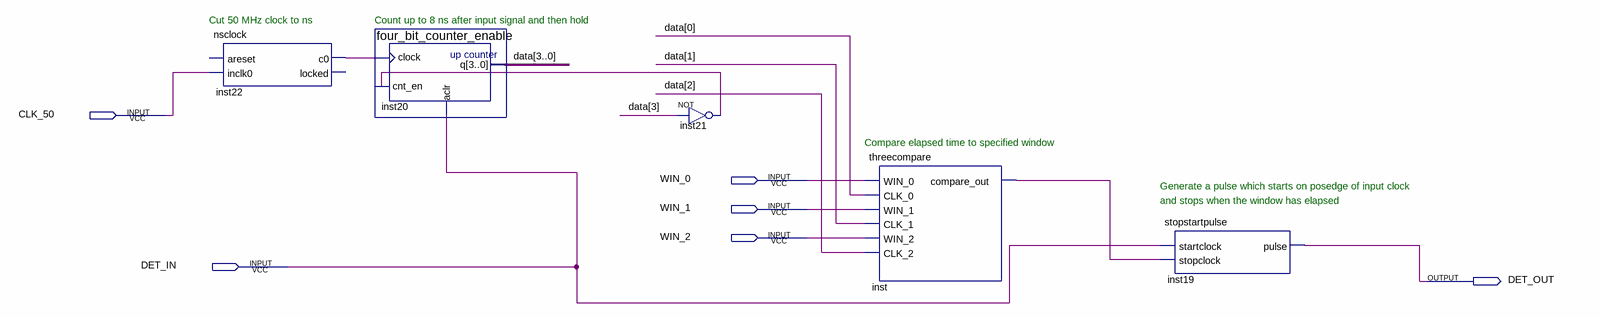
[diagram p0: schematic sheet]
// Quartus schematic extendsignal.bdf as structural Verilog: 5 symbols, 6 pins
module extendsignal (
  input  CLK_50,
  input  WIN_0,
  input  WIN_1,
  input  WIN_2,
  input  DET_IN,
  output DET_OUT
);

  wire inst21_out, inst22_c0, inst_compare_out;
  wire [3:0] data;

  nsclock inst22 (.inclk0(CLK_50), .c0(inst22_c0));  // open: areset, locked
  four_bit_counter_enable inst20 (.clock(inst22_c0), .cnt_en(inst21_out), .aclr(DET_IN), .q(data));
  not inst21 (inst21_out, data[3]);
  threecompare inst (
    .WIN_0(WIN_0), .CLK_0(data[0]), .WIN_1(WIN_1), .CLK_1(data[1]), .WIN_2(WIN_2), .CLK_2(data[2]),
    .compare_out(inst_compare_out));
  stopstartpulse inst19 (.startclock(DET_IN), .stopclock(inst_compare_out), .pulse(DET_OUT));

  // Notes on the sheet:
  //   Cut 50 MHz clock to ns
  //   Count up to 8 ns after input signal and then hold
  //   Compare elapsed time to specified window
  //   Generate a pulse which starts on posedge of input clock
  //   and stops when the window has elapsed
endmodule
